# EAGLE design PE02 (EAGLE 6.3)
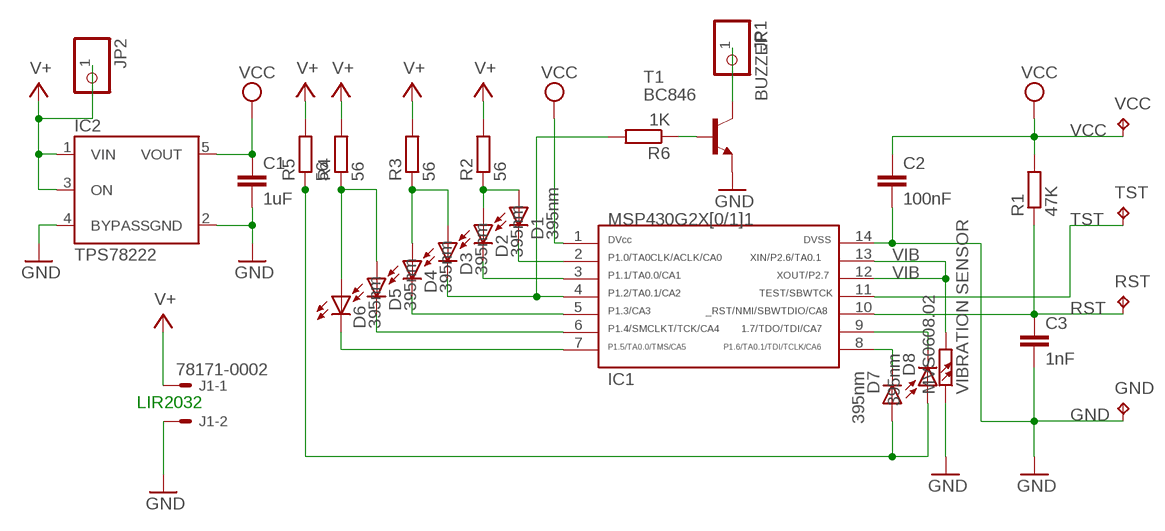
[diagram p0: schematic, sheet 1]

## Parts
C1  1uF  CAP0805  [0805]
C2  100nF  CAP0805  [0805]
C3  1nF  CAP0805  [0805]
D1  395nm  LED-3MM  [LED-3MM]
D2  395nm  LED-3MM  [LED-3MM]
D3  395nm  LED-3MM  [LED-3MM]
D4  395nm  LED-3MM  [LED-3MM]
D5  395nm  LED-3MM  [LED-3MM]
D6  395nm  LED-3MM  [LED-3MM]
D7  395nm  LED-3MM  [LED-3MM]
D8  395nm  LED-3MM  [LED-3MM]
GND  TPTP10R  [TP10R]
IC1  MSP430G2231  G2X[0/1]1---PW14  [PW14]
IC2  TPS78222  LP2982M5  [SOT23-5]
J1  78171-0002  [78171-0002]
JP1  PINHD-1X1CB  [1X01-CLEANBIG]
JP2  PINHD-1X1CB  [1X01-CLEANBIG]
MVS0608.02  VIBRATION SENSOR  R-EU_R1210  [R1210]
R1  47K  R-EU_R0603  [R0603]
R2  56  R-EU_R0603  [R0603]
R3  56  R-EU_R0603  [R0603]
R4  56  R-EU_R0603  [R0603]
R5  56  R-EU_R0603  [R0603]
R6  1K  R-EU_R0603  [R0603]
RST  TPTP10R  [TP10R]
T1  BC846  [SOT23]
TST  TPTP10R  [TP10R]
VCC  TPTP10R  [TP10R]

## Nets
BUZZER: JP1.1 T1.3(C)
GND: C1.2 C2.2 C3.2 GND.TP IC1.14 IC2.2(GND) IC2.4(BYPASS) J1.2 MVS0608.02.1 T1.2(E)
N$1: D6.K(C) IC1.7
N$2: D5.K(C) IC1.6
N$3: D8.K(C) IC1.9
N$4: D7.K(C) IC1.8
N$5: D4.K(C) IC1.5
N$7: D3.K(C) IC1.4 R6.2
N$8: D1.K(C) IC1.2
N$9: R6.1 T1.1(B)
N$10: D7.A D8.A R5.1
N$12: D2.K(C) IC1.3
N$20: D3.A D4.A R3.1
N$21: D5.A D6.A R4.1
N$23: D1.A D2.A R2.1
RST: C3.1 IC1.10 R1.1 RST.TP
TST: IC1.11 TST.TP
V+: IC2.1(VIN) IC2.3(ON) J1.1 JP2.1 R2.2 R3.2 R4.2 R5.2
VCC: C1.1 C2.1 IC1.1 IC2.5(VOUT) R1.2 VCC.TP
VIB: IC1.12 IC1.13 MVS0608.02.2

## Notes on the sheet
- LIR2032

## Library data of the parts
C1-C3 = SparkFun:CAP: Capacitor Standard 0603 ceramic capacitor, and 0.1" leaded capacitor.
D1-D8 = dp_devices:LED: Light Emitting Diode
GND RST TST VCC = testpad:TP: Test pad
IC1 = TI_MSP430_v16:G2X[0/1]1---PW14: MSP430G2X[0/1]1 MSP430G2001, MSP430G2101, MSP430G2201,MSP430G2111, G2211 TSSOP (PW) 14 Pin Package http://focus.ti.com/docs/prod/folders/print/msp430g2111.html
IC2 = v-reg-3:LP2982: National Semiconductor <http://www.national.com> Micropower Linear Regulator 50mA regulated output, Vin 16V max., ultra-low dropout of 120mV @ 50mA, 1µA standby current, low noise
J1 = con-molex-pico-ezmate:78171-0002: CONNECTOR wire to board 2.54 mm (.1 inch) pitch header
JP1 JP2 = adafruit:PINHD-1X1: Pin header 1x1 for 0.1" spacing With round pins
MVS0608.02 R1-R6 = rcl:R-EU_: RESISTOR, European symbol
T1 = transistor:BC846: NPN TRANSISTOR

## Board
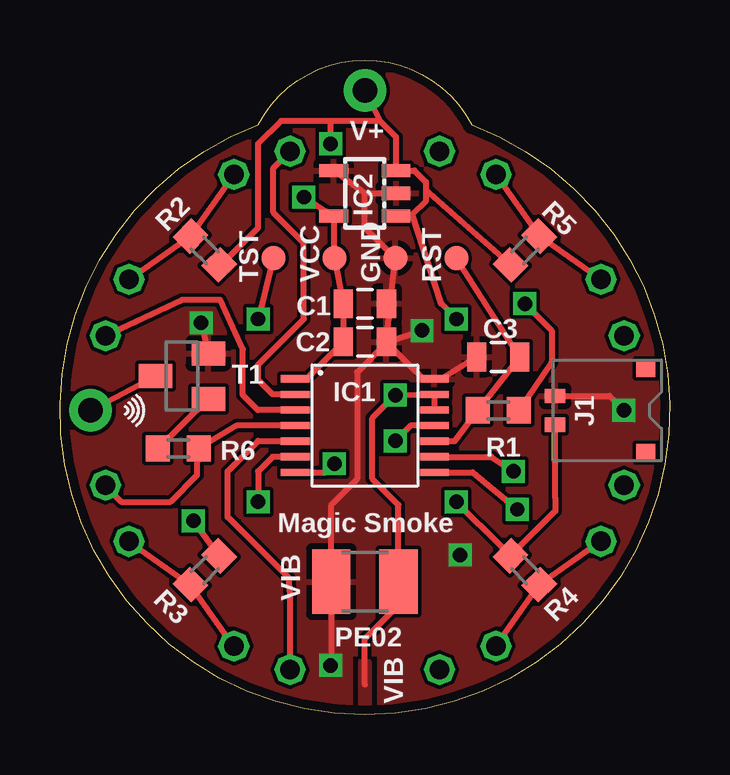
[diagram p1: board, top side]
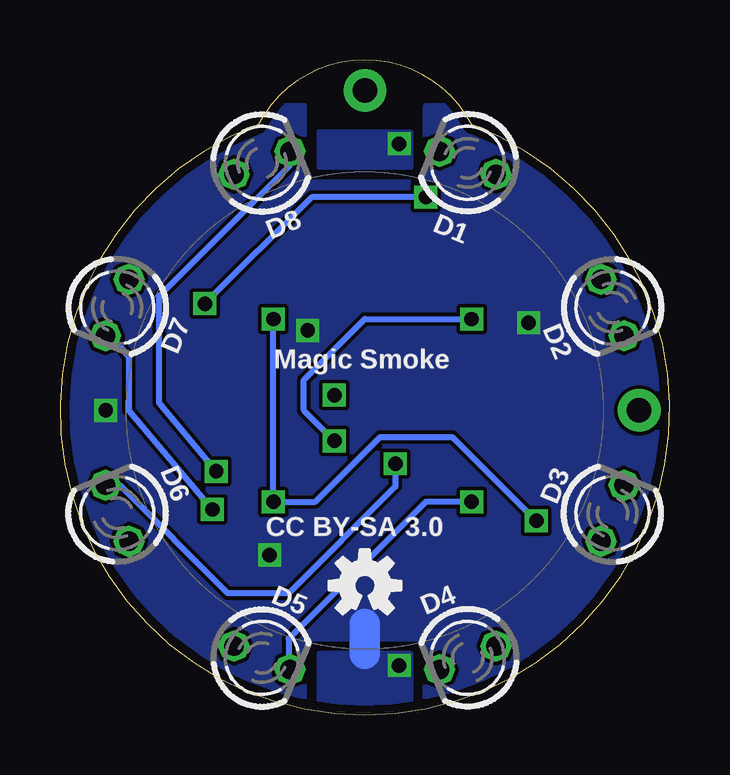
[diagram p2: board, bottom side, seen from below]

Size 25.41 x 27.31 mm. Coordinates in mm from the lower left corner, seen from the top.
Outline: 8.26,24.61 arc-125 17.15,24.61 arc-160 12.7,0 arc-160 8.26,24.61
Copper layers (1*16): Top 0.0356mm / dielectric 1.5011mm / Bottom 0.0356mm
Design rules "LaenPCBOrder *": minimum track width 6mil, minimum drill 13mil, track to track 6mil, track to pad 6mil, pad to pad 6mil, via to via 6mil, smd to smd 6mil, copper to edge 15mil, drill to drill 6mil, minimum pad ring 7mil, minimum via ring 7mil, stop-mask expansion 3mil, vias tented up to drill 24mil, thermal gap 10mil

### Footprints (pad centres in the part's own frame; a part is rotated, then mirrored left to right if it is on the bottom)
0805 = smd 0.8 x 1.2: 1 -0.9,0; 2 0.9,0
LED-3MM = drill 0.813 octagon: A -1.27,0; K 1.27,0
TP10R = smd 1 x 1: TP 0,0
PW14 = smd 0.3 x 1.2: 1 -1.95,-2.9; 2 -1.3,-2.9; 3 -0.65,-2.9; 4 0,-2.9; 5 0.65,-2.9; 6 1.3,-2.9; 7 1.95,-2.9; 8 1.95,2.9; 9 1.3,2.9; 10 0.65,2.9; 11 0,2.9; 12 -0.65,2.9; 13 -1.3,2.9; 14 -1.95,2.9
SOT23-5 = smd 0.55 x 1.2: 1 -0.95,-1.3; 2 0,-1.3; 3 0.95,-1.3; 4 0.95,1.3; 5 -0.95,1.3
78171-0002 = smd 0.6 x 0.85: 1 -0.6,2.075; 2 0.6,2.075 | smd 0.7 x 0.8: LEFT -1.75,-1.7; RIGHT 1.75,-1.7
1X01-CLEANBIG = drill 1.016 pad 1.778: 1 0,0
R1210 = smd 1.6 x 2.7: 1 -1.4,0; 2 1.4,0
R0603 = smd 1 x 1.1: 1 -0.85,0; 2 0.85,0
SOT23 = smd 1 x 1.4: 1 -0.95,-1.1; 2 0.95,-1.1; 3 0,1.1

### Placement (x,y rotation side)
C1  12.7,17.15 0 top
C2  12.7,15.56 0 top
C3  18.26,14.92 180 top
D1  8.42,23.02 157.5 bottom
D2  2.38,16.99 292.5 bottom
D3  2.38,8.41 67.5 bottom
D4  8.42,2.38 202.5 bottom
D5  16.99,2.38 337.5 bottom
D6  23.02,8.41 112.5 bottom
D7  23.02,16.99 247.5 bottom
D8  16.99,23.02 22.5 bottom
GND  13.97,19.05 210 top
IC1  12.7,12.06 270 top
IC2  12.7,21.75 90 top
J1  22.7,12.7 90 top
JP1  1.27,12.7 0 top
JP2  12.7,26.04 0 top
MVS0608.02  12.7,5.56 0 top
R1  18.26,12.7 0 top
R2  6.04,19.37 315 top
R3  6.04,6.03 45 top
R4  19.37,6.03 135 top
R5  19.37,19.37 225 top
R6  4.92,11.11 0 top
RST  16.51,19.05 150 top
T1  5.08,14.13 90 top
TST  8.89,19.05 210 top
U$1  [OSHW-LOGO-S]  12.7,5.4 0 bottom
VCC  11.43,19.05 150 top

### Tracks (layer width: path | path; a pad name or v marks a point on that pad's centre or on a via)
BUZZER
  Top 0.254: JP1.1 T1.3
GND  (via drill 0.6)
  Top 0.254: C2.2 13.71,16.54 | 13.71,16.54 GND.TP 12.7,20.32 12.7,21.75 | 12.7,21.75 IC2.2 | 12.7,21.75 IC2.4 | IC1.14 15.15,14.02 C2.2 | C3.2 15.93,14.02 15.88,13.97 15.65,13.97 IC1.14 | 15.56,13.97 IC1.14 | C2.2 13.6,15.51 12.39,14.29 12.39,9.84 11.3,8.76 MVS0608.02.1 11.3,2.67 v11.27,2.06 | J1.2 22.9,13.3 v23.5,12.7 | v5.88,16.35 T1.2 | C2.2 v15.08,16.03 | C1.2 13.71,16.54
  Bottom 1.27: 12.7,3.81 12.7,2.54
  other vias: 16.67,6.67
  pour Bottom: 0,25.4 0,0 10.16,0 10.16,3.17 15.24,3.17 15.24,0 25.4,0 25.4,25.4 15.24,25.4 15.24,22.23 10.16,22.23 10.16,25.4
  pour Top: -1.27,26.67 26.67,26.67 26.67,-1.27 13.34,-1.27 13.34,2.54 12.07,2.54 12.07,-1.27 -1.27,-1.27
  pour Bottom: 10.8,0 10.8,2.54 14.61,2.54 14.61,0
N$1  (via drill 0.6)
  Top 0.254: IC1.7 11.07,10.12 v11.43,10.48
  Bottom 0.254: v11.43,10.48 11.43,9.53 15.88,5.08 18.42,5.08 22.92,9.59 D6.K
N$2  (via drill 0.6)
  Top 0.254: IC1.6 8.86,10.77 8.26,10.16 v8.26,8.89
  Bottom 0.254: v8.26,8.89 10.16,8.89 15.88,3.17 15.88,1.96 D5.K
N$3  (via drill 0.6)
  Top 0.254: IC1.9 17.97,10.77 v18.89,10.16
  Bottom 0.254: D8.K 15.82,22.92 21.28,17.46 21.28,13.02 v18.89,10.16
N$4  (via drill 0.6)
  Top 0.254: IC1.8 17.19,10.12 v19.05,8.57
  Bottom 0.254: D7.K 23.28,15.81 22.55,14.92 22.55,12.7 v19.05,8.57
N$5
  Top 0.254: D4.K 9.59,5.02 9.53,5.71 6.99,8.25 6.99,10.16 8.26,11.43 9.79,11.43 IC1.5
N$7
  Top 0.254: IC1.4 7.36,12.06 R6.2 5.72,10.42 5.72,10 4.61,8.89 2.54,8.89 1.9,9.54 D3.K
N$8
  Top 0.254: IC1.2 8.86,13.37 8.26,13.97 8.26,14.6 10.16,16.51 10.16,19.69 8.89,20.96 8.89,22.81 D1.K
N$9
  Top 0.254: R6.1 T1.1
N$10
  Top 0.254: D8.A R5.1 D7.A
N$12
  Top 0.254: IC1.3 8.24,12.71 7.62,13.33 7.62,15.24 6.67,17.3 5.08,17.3 D2.K
N$20
  Top 0.254: D3.A R3.1 D4.A
N$21
  Top 0.254: D5.A R4.1 D6.A
N$23
  Top 0.254: D1.A R2.1 D2.A
RST
  Top 0.254: RST.TP C3.1 R1.1 16.44,11.41 IC1.10
TST  (via drill 0.6)
  Top 0.254: TST.TP v8.26,16.51 | IC1.11 14.61,12.06 v13.97,11.43
  Bottom 0.254: v8.26,16.51 12.7,16.51 15.24,13.97 15.24,12.7 v13.97,11.43
V+  (via drill 0.6)
  Top 0.254: IC2.1 14.61,20.8 14.69,20.88 | R5.2 18.64,18.89 15.24,21.91 | 15.24,21.91 15.24,22.23 14.77,22.7 IC2.3 14,24.1 13.34,24.77 | 15.24,21.91 15.24,21.43 14.69,20.88 | 6.64,6.7 R3.2 v5.56,8.1 | R2.2 6.7,18.77 8.26,20.32 8.26,23.81 9.21,24.77 11.27,24.77 | v16.51,16.51 15.88,17.15 14.69,20.88 | 18.42,6.98 R4.2 20.64,8.5 20.64,9.05 J1.1 | 18.42,6.98 v16.51,8.89 | 18.42,6.98 19.05,6.98 | 13.34,24.77 11.27,24.77 | v11.27,23.81 11.27,24.77 | JP2.1 13.34,24.77
  Bottom 0.254: v16.51,16.51 v16.51,8.89 14.77,8.89 12.07,11.59 9.05,11.59 v5.56,8.1
  pour Bottom: 10.8,22.86 10.8,24.29 14.61,24.29 14.61,22.86
VCC  (via drill 0.6)
  Top 0.254: IC1.1 10.26,14.02 C2.1 C1.1 VCC.TP 11.43,20.77 IC2.5 v10.16,21.59 | v19.37,17.15 20.48,16.03 20.48,14.71 R1.2
  Bottom 0.254: v10.16,21.59 14.92,21.59 v19.37,17.15
VIB  (via drill 0.6)
  Top 0.254: 15.88,12.7 IC1.12 IC1.13 v13.97,13.33 13.02,12.38 13.02,9.84 14.1,8.76 MVS0608.02.2 14.1,4.58 13.97,4.44 | 12.7,1.27 12.7,3.17 13.97,4.44 | 13.97,4.44 13.97,5.71
  pour Top: 12.54,-0.16 12.54,2.22 12.86,2.22 12.86,-0.16

### Text on the board
tPlace: V+ | Magic Smoke | PE02
bPlace: Magic Smoke | CC BY-SA 3.0
tNames: VIB | VIB